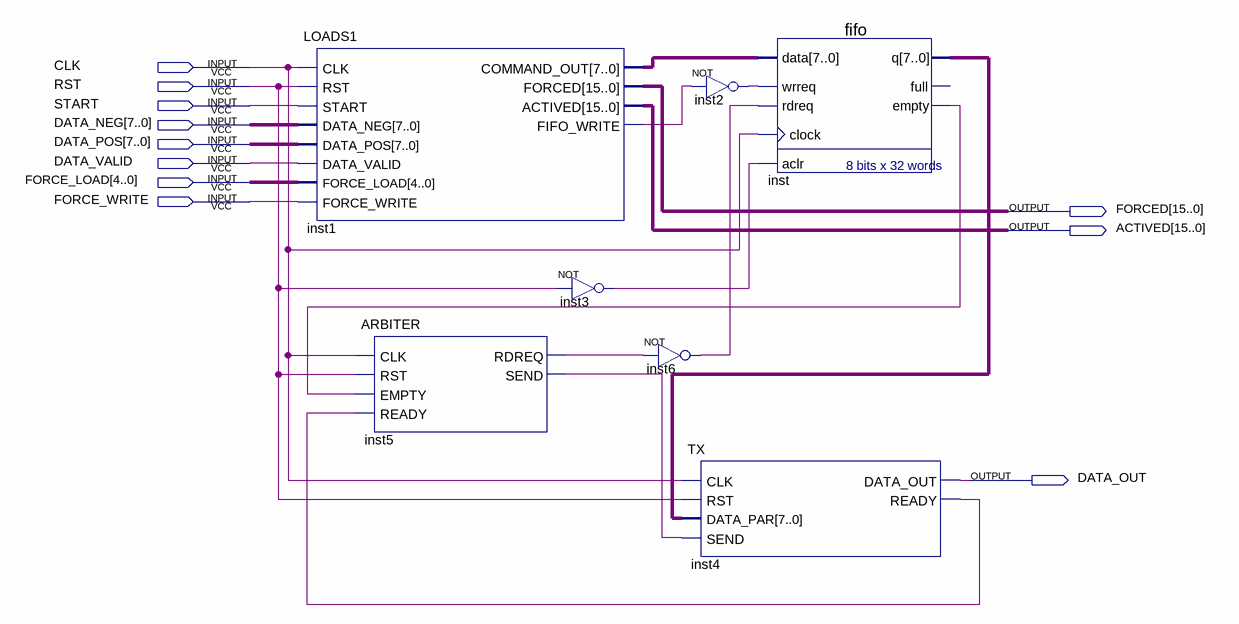
[diagram p0: schematic sheet]
// Quartus schematic loads.bdf as structural Verilog: 7 symbols, 11 pins
module loads (
  input  CLK,
  input  RST,
  input  START,
  input  [7:0] DATA_NEG,
  input  [7:0] DATA_POS,
  input  DATA_VALID,
  input  [4:0] FORCE_LOAD,
  input  FORCE_WRITE,
  output [15:0] FORCED,
  output [15:0] ACTIVED,
  output DATA_OUT
);

  wire inst1_fifo_write, inst2_out, inst3_out, inst4_ready, inst5_rdreq, inst5_send, inst6_out, inst_empty;
  wire [7:0] inst1_command_out, inst_q;

  LOADS1 inst1 (
    .CLK(CLK), .RST(RST), .START(START), .DATA_NEG(DATA_NEG), .DATA_POS(DATA_POS), .DATA_VALID(DATA_VALID),
    .FORCE_LOAD(FORCE_LOAD), .FORCE_WRITE(FORCE_WRITE), .COMMAND_OUT(inst1_command_out), .FORCED(FORCED),
    .ACTIVED(ACTIVED), .FIFO_WRITE(inst1_fifo_write));
  ARBITER inst5 (.CLK(CLK), .RST(RST), .EMPTY(inst_empty), .READY(inst4_ready), .RDREQ(inst5_rdreq), .SEND(inst5_send));
  not inst3 (inst3_out, RST);
  not inst2 (inst2_out, inst1_fifo_write);
  not inst6 (inst6_out, inst5_rdreq);
  TX inst4 (.CLK(CLK), .RST(RST), .DATA_PAR(inst_q), .SEND(inst5_send), .DATA_OUT(DATA_OUT), .READY(inst4_ready));
  fifo inst (
    .data(inst1_command_out), .wrreq(inst2_out), .rdreq(inst6_out), .clock(CLK), .aclr(inst3_out),
    .q(inst_q), .empty(inst_empty));  // open: full
endmodule
